# EAGLE design motortreiber_simple (EAGLE 9.6.2)
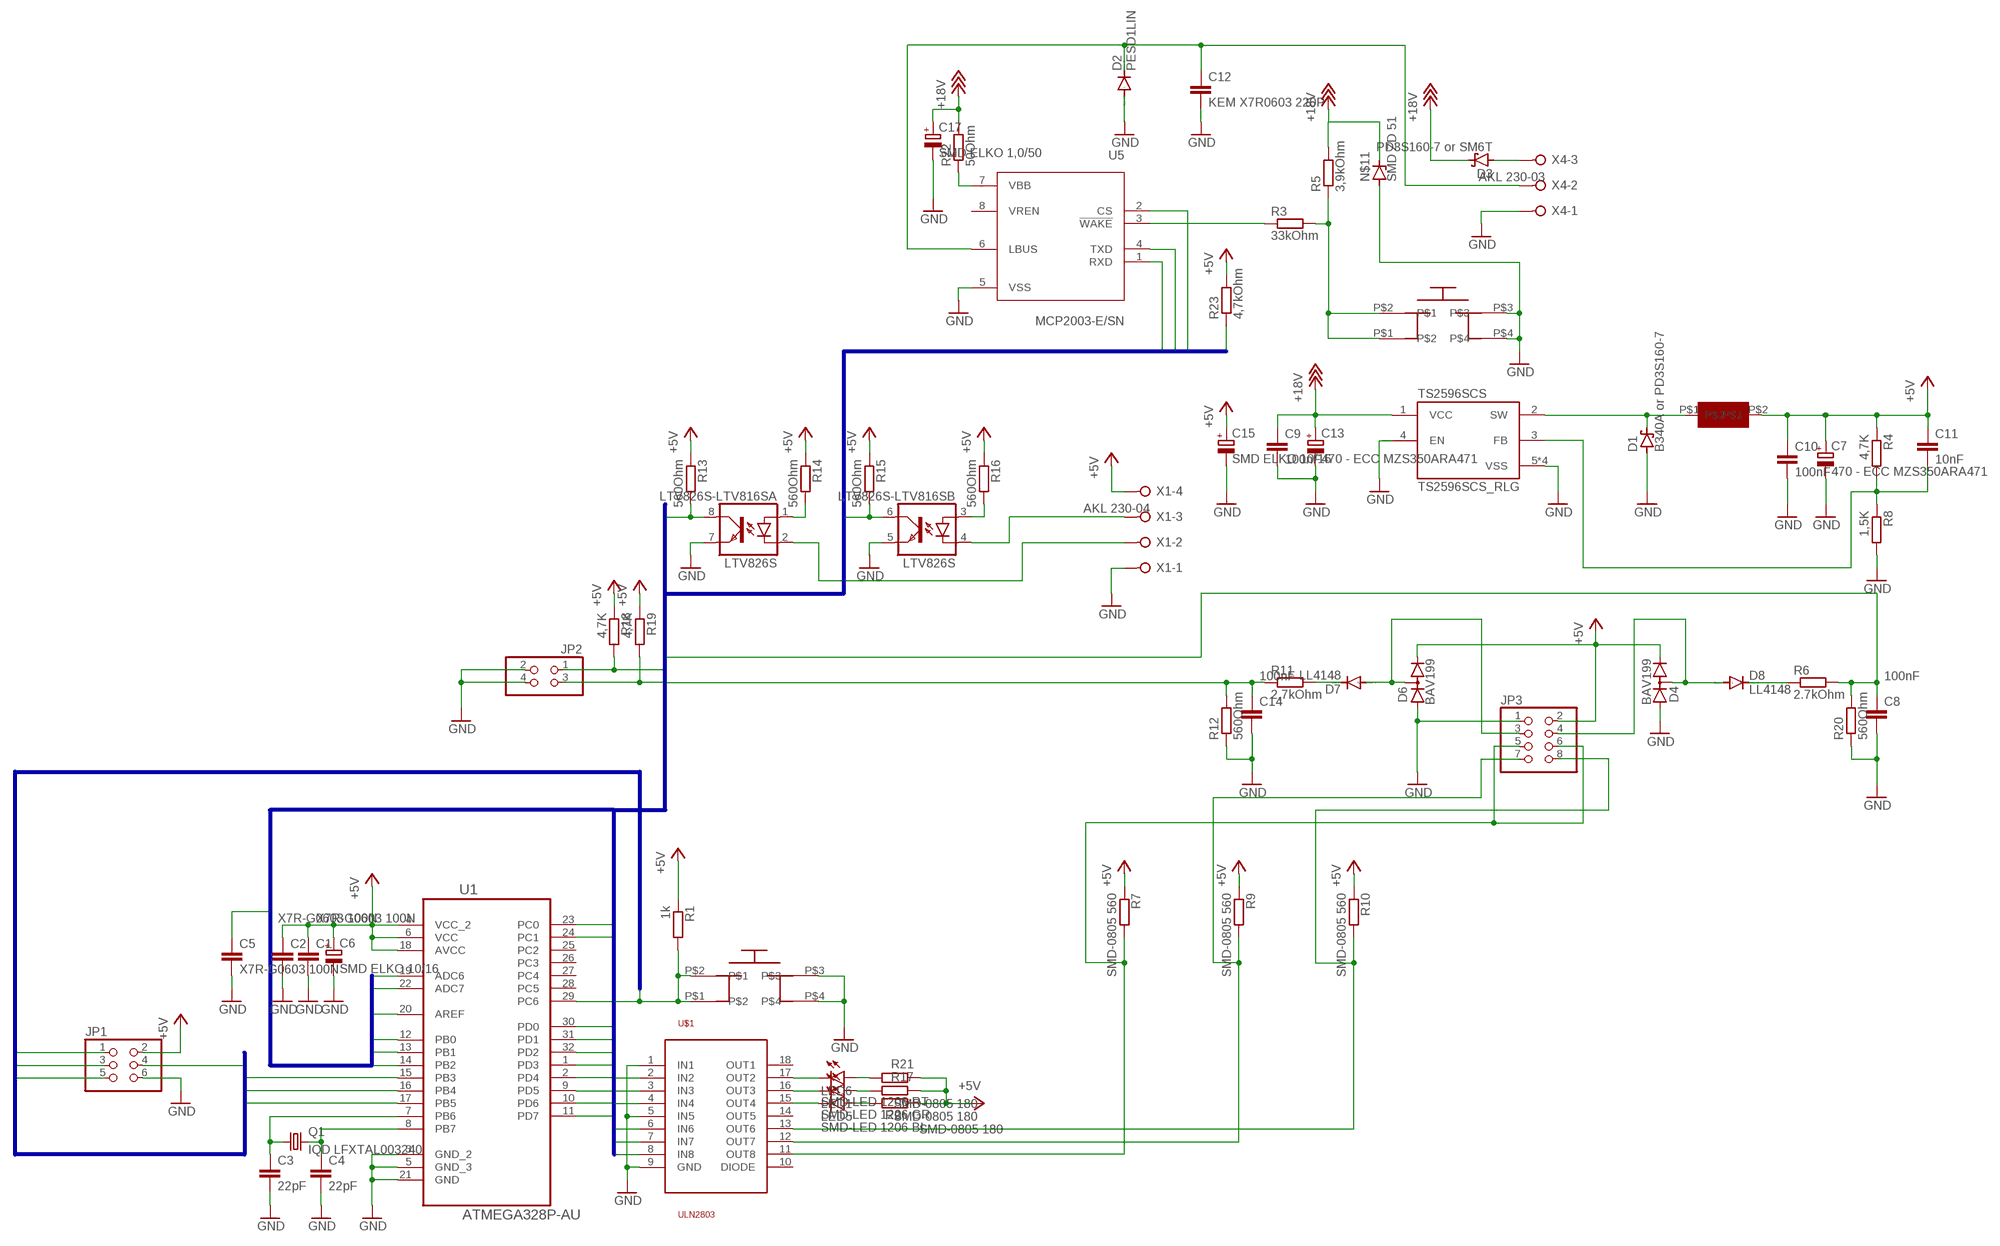
[diagram p0: schematic, sheet 1]

## Parts
C1  X7R-G0603 100N  C-EUC0603  [C0603]
C2  X7R-G0603 100N  C-EUC0603  [C0603]
C3  22pF  C-EUC0603  [C0603]
C4  22pF  C-EUC0603  [C0603]
C5  X7R-G0603 100N  C-EUC0603  [C0603]
C6  SMD ELKO 10/16  CPOL-EU153CLV-0505  [153CLV-0505]
C7  470 - ECC MZS350ARA471  CPOL-EU175TMP-0810  [175TMP-0810]
C8  100nF  C-EUC0603  [C0603]
C9  100nF  C-EUC0603  [C0603]
C10  100nF  C-EUC0603  [C0603]
C11  10nF  C-EUC0603  [C0603]
C12  KEM X7R0603 220P  C-EUC0603  [C0603]
C13  470 - ECC MZS350ARA471  CPOL-EU175TMP-0810  [175TMP-0810]
C14  100nF  C-EUC0603  [C0603]
C15  SMD ELKO 10/16  CPOL-EU153CLV-0505  [153CLV-0505]
C17  SMD ELKO 1,0/50  CPOL-EU153CLV-0405  [153CLV-0405]
D1  B340A or PD3S160-7  SCHOTTKY-DIODESMD  [SMB]
D2  PESD1LIN  DIODE-SOD323-W  [SOD323-W]
D3  PD3S160-7 or SM6T  SCHOTTKY-DIODESMD  [SMB]
D4  BAV199  [SOT23]
D6  BAV199  [SOT23]
D7  LL4148  DIODE-SOD323-W  [SOD323-W]
D8  LL4148  DIODE-SOD323-W  [SOD323-W]
JP1  PINHD-2X3  [2X03]
JP2  PINHD-2X2  [2X02]
JP3  PINHD-2X4  [2X04]
L-05HCP33  LDEVICE2-5MM  [LFOOT2-5MM]
LED1  SMD-LED 1206 GR  LEDCHIPLED_1206  [CHIPLED_1206]
LED5  SMD-LED 1206 BL  LEDCHIPLED_1206  [CHIPLED_1206]
LED6  SMD-LED 1206 RT  LEDCHIPLED_1206  [CHIPLED_1206]
LTV826S-LTV816S  LTV826S  [DIL8-SMD]
N$11  SMD ZD 51  ZENER-DIODESOT23  [SOT23]
Q1  IQD LFXTAL003240  CRYSTALHC49U-V  [HC49U-V]
R1  1k  R-EU_R0805  [R0805]
R2  SMD-0805 180  R-EU_R0805  [R0805]
R3  33kOhm  R-EU_R0805  [R0805]
R4  4,7K  R-EU_R0805  [R0805]
R5  3,9kOhm  R-EU_R0805  [R0805]
R6  2.7kOhm  R-EU_R0805  [R0805]
R7  SMD-0805 560  R-EU_R0805  [R0805]
R8  1,5K  R-EU_R0805  [R0805]
R9  SMD-0805 560  R-EU_R0805  [R0805]
R10  SMD-0805 560  R-EU_R0805  [R0805]
R11  2,7kOhm  R-EU_R0805  [R0805]
R12  560Ohm  R-EU_R0805  [R0805]
R13  560Ohm  R-EU_R0805  [R0805]
R14  560Ohm  R-EU_R0805  [R0805]
R15  560Ohm  R-EU_R0805  [R0805]
R16  560Ohm  R-EU_R0805  [R0805]
R17  SMD-0805 180  R-EU_R0805  [R0805]
R18  4,7K  R-EU_R0805  [R0805]
R19  4,7K  R-EU_R0805  [R0805]
R20  560Ohm  R-EU_R0805  [R0805]
R21  SMD-0805 180  R-EU_R0805  [R0805]
R22  50Ohm  R-EU_R0805  [R0805]
R23  4,7kOhm  R-EU_R0805  [R0805]
TASTER9313-1  SCHALTDEV  [SCHALTFOOT]
TASTER9313-2  SCHALTDEV  [SCHALTFOOT]
TS2596SCS  TS2596SCS_RLG  [SOP127P600X200-8N]
U1  ATMEGA328P-AU  [QFP80P900X900X120-32N]
U5  MCP2003-E/SN  [SOIC127P600X175-8N]
U$1  ULN2803  [SO18L]
X1  AKL 230-04  W237-04P  [W237-4P]
X4  AKL 230-03  W237-3E  [W237-3E]

## Nets
+5V: C1.1 C2.1 C6.+ C7.+ C10.1 C11.1 C15.+ D4.2(C) D6.2(C) JP1.2 JP3.2 L-05HCP33.P$2 R1.1 R2.1 R4.1 R7.1 R9.1 R10.1 R13.1 R14.1 R15.1 R16.1 R17.1 R18.1 R19.1 R21.1 R23.2 U1.4(VCC_2) U1.6(VCC) U1.18(AVCC) X1.4
+18V: C9.1 C13.+ C17.+ D3.C N$11.3(C) R5.2 R22.2 TS2596SCS.1(VCC)
ADC6: C8.1 R6.2 R20.2 U1.19(ADC6)
ADC7: C14.1 R11.1 R12.2 U1.22(ADC7)
AREF: C5.1 U1.20(AREF)
CLK: JP1.3 U1.17(PB5)
GND: C1.2 C2.2 C3.2 C4.2 C5.2 C6.- C7.- C8.2 C9.2 C10.2 C12.2 C13.- C14.2 C15.- C17.- D1.A D2.A D4.1(A) D6.1(A) JP1.6 JP2.2 JP2.4 JP3.1 LTV826S-LTV816S.5(B:EMIT) LTV826S-LTV816S.7(A:EMIT) N$11.1(A) R8.2 R12.1 R20.1 TASTER9313-1.P$3 TASTER9313-1.P$4 TASTER9313-2.P$3 TASTER9313-2.P$4 TS2596SCS.4(EN) TS2596SCS.5(VSS) TS2596SCS.6(VSS) TS2596SCS.7(VSS) TS2596SCS.8(VSS) U1.3(GND_2) U1.5(GND_3) U1.21(GND) U5.5(VSS) U$1.1(IN1) U$1.5(IN5) U$1.9(GND) X1.1 X4.1
INT0: LTV826S-LTV816S.8(A:COL) R13.2 U1.32(PD2)
INT1: LTV826S-LTV816S.6(B:COL) R15.2 U1.1(PD3)
LED0: U1.12(PB0) U$1.4(IN4)
LED1: U1.13(PB1) U$1.3(IN3)
LED2: U1.14(PB2) U$1.2(IN2)
MISO: JP1.1 U1.16(PB4)
MOSI: JP1.4 U1.15(PB3)
N$1: LTV826S-LTV816S.3(B:A) R16.2
N$2: LTV826S-LTV816S.4(B:C) X1.3
N$3: LTV826S-LTV816S.2(A:C) X1.2
N$4: LTV826S-LTV816S.1(A:A) R14.2
N$5: R22.1 U5.7(VBB)
N$6: LED6.C U$1.17(OUT2)
N$7: LED5.A R2.2
N$8: LED1.A R17.2
N$9: C3.1 Q1.1 U1.7(PB6)
N$10: C4.1 Q1.2 U1.8(PB7)
N$11: C12.1 D2.C U5.6(LBUS) X4.2
N$12: R3.1 U5.3(!WAKE)
N$13: D1.C L-05HCP33.P$1 TS2596SCS.2(SW)
N$14: C11.2 R4.2 R8.1 TS2596SCS.3(FB)
N$15: JP3.5 JP3.6 R7.2 U$1.11(OUT8)
N$16: D6.3(AC) D7.A JP3.3
N$17: R3.2 R5.1 TASTER9313-1.P$1 TASTER9313-1.P$2
N$18: D3.A X4.3
N$19: D4.3(AC) D8.A JP3.4
N$20: D7.C R11.2
N$21: JP3.7 R9.2 U$1.12(OUT7)
N$22: D8.C R6.1
N$23: LED1.C U$1.16(OUT3)
N$25: LED6.A R21.2
N$26: LED5.C U$1.15(OUT4)
N$28: JP3.8 R10.2 U$1.13(OUT6)
NSLP: U1.2(PD4) U5.2(CS)
O0: U1.10(PD6) U$1.7(IN7)
O1: U1.11(PD7) U$1.6(IN6)
P0: JP2.3 R19.2 U1.23(PC0)
P1: JP2.1 R18.2 U1.24(PC1)
PWM: U1.9(PD5) U$1.8(IN8)
RESET: JP1.5 R1.2 TASTER9313-2.P$1 TASTER9313-2.P$2 U1.29(PC6)
RX: R23.1 U1.30(PD0) U5.1(RXD)
TX: U1.31(PD1) U5.4(TXD)
Unconnected: U1.25(PC2) U1.26(PC3) U1.27(PC4) U1.28(PC5) U5.8(VREN) U$1.10(DIODE) U$1.14(OUT5) U$1.18(OUT1)

## Buses
AUX:ADC6,ADC7,AREF,INT0,INT1,LED0,LED1,LED2,LED3,NSLP,O0,O1,O2,O3,P0,P1,PWM,RX,TX
ICSP:CLK,MISO,MOSI,RESET

## Library data of the parts
C1-C5 C8-C12 C14 = rcl:C-EU: CAPACITOR, European symbol; SPICEPREFIX: C
C6 C7 C13 C15 C17 = rcl:CPOL-EU: POLARIZED CAPACITOR, European symbol; SPICEPREFIX: C
D1 D3 = diode:SCHOTTKY-DIODE: Schottky Diode
D2 D7 D8 = diode:DIODE-: DIODE
D4 D6 = diode:BAV199: DIODE low-leakage double diode
JP1 = pinhead:PINHD-2X3: PIN HEADER
JP2 = pinhead:PINHD-2X2: PIN HEADER
JP3 = pinhead:PINHD-2X4: PIN HEADER
L-05HCP33 = own:LDEVICE2-5MM
LED1 LED5 LED6 = led:LED: LED OSRAM: - CHIPLED LG R971, LG N971, LY N971, LG Q971, LY Q971, LO R971, LY R971 LH N974, LH R974 LS Q976, LO Q976, LY Q976 LO Q996 - Hyper CHIPLED LW Q18S LB Q993, LB Q99A, LB R99A - SideLED LS A670, LO A670, LY A670, LG A670, LP A670 LB A673, LV A673, LT A673, LW A673 LH A674 LY A675 LS A676, LA A676, LO A676, LY A676, LW A676 LS A679, LY A679, LG A679 - Hyper Micro SIDELED® LS Y876, LA Y876, LO Y876, LY Y876 LT Y87S - SmartLED LW L88C, LW L88S LB L89C, LB L89S, LG L890 LS L89K, LO L89K, LY L89K LS L896, LA L896, LO L896, LY L896 - TOPLED LS T670, LO T670, LY T670, LG T670, LP T670 LSG T670, LSP T670, LSY T670, LOP T670, LYG T670 LG T671, LOG T671, LSG T671 LB T673, LV T673, LT T673, LW T673 LH T674 LS T676, LA T676, LO T676, LY T676, LB T676, LH T676, LSB T676, LW T676 LB T67C, LV T67C, LT T67C, LS T67K, LO T67K, LY T67K, LW E67C LS E67B, LA E67B, LO E67B, LY E67B, LB E67C, LV E67C, LT E67C LW T67C LS T679, LY T679, LG T679 LS T770, LO T770, LY T770, LG T770, LP T770 LB T773, LV T773, LT T773, LW T773 LH T774 LS E675, LA E675, LY E675, LS T675 LS T776, LA T776, LO T776, LY T776, LB T776 LHGB T686 LT T68C, LB T68C - Hyper Mini TOPLED® LB M676 - Mini TOPLED Santana® LG M470 LS M47K, LO M47K, LY M47K Source: http://www.osram.convergy.de LUXEON: - LUMILED® LXK2-PW12-R00, LXK2-PW12-S00, LXK2-PW14-U00, LXK2-PW14-V00 LXK2-PM12-R00, LXK2-PM12-S00, LXK2-PM14-U00 LXK2-PE12-Q00, LXK2-PE12-R00, LXK2-PE12-S00, LXK2-PE14-T00, LXK2-PE14-U00 LXK2-PB12-K00, LXK2-PB12-L00, LXK2-PB12-M00, LXK2-PB14-N00, LXK2-PB14-P00, LXK2-PB14-Q00 LXK2-PR12-L00, LXK2-PR12-M00, LXK2-PR14-Q00, LXK2-PR14-R00 LXK2-PD12-Q00, LXK2-PD12-R00, LXK2-PD12-S00 LXK2-PH12-R00, LXK2-PH12-S00 LXK2-PL12-P00, LXK2-PL12-Q00, LXK2-PL12-R00 Source: www.luxeon.com KINGBRIGHT: KA-3528ASYC Source: www.kingbright.com
LTV826S-LTV816S = optocoupler:LTV826: OPTO COUPLER Source: LITEON, LTV816.pdf; OC_FARNELL: unknown; OC_NEWARK: unknown
N$11 = diode:ZENER-DIODE: Z-Diode
Q1 = crystal:CRYSTAL: CRYSTAL; OC_FARNELL: 1666969; OC_NEWARK: unknown
R1-R23 = rcl:R-EU_: RESISTOR, European symbol; SPICEPREFIX: R
TASTER9313-1 TASTER9313-2 = own:SCHALTDEV
TS2596SCS = TS2596SCS_RLG:TS2596SCS_RLG; MANUFACTURER: Taiwan Semiconductor; MAXIMUM_PACKAGE_HEIGHT: 2.00mm; PARTREV: C1602; STANDARD: IPC-7351B
U1 = Atmel_By_element14_Batch_1-00:ATMEGA328P-AU: 8-bit Microcontroller with In-System Programmable Flash; MPN: ATMEGA328P-AU; OC_FARNELL: 1715486; OC_NEWARK: 14R4631; PACKAGE: TQFP-32; SUPPLIER: Atmel
U5 = MCP2003-E_SN:MCP2003-E/SN: MCP2003 Series 6 to 27 V Bidirectional LIN J2602 Transceiver SMT - SOIC-8; A1_MIN: 0.1; A_MAX: 1.75; A_MIN: 1.75; A_NOM: 1.75; B_MAX: 0.51; B_MIN: 0.31; B_NOM: 0.41; D2_MAX: 0.0; D_MAX: 4.9; D_MIN: 4.9; D_NOM: 4.9; E1_MAX: 3.9; E1_MIN: 3.9; E1_NOM: 3.9; E2_MAX: 0.0; ENOM: 1.27; E_MAX: 6.0; E_MIN: 6.0; E_NOM: 6.0; L_MAX: 1.27; L_MIN: 0.4; L_NOM: 0.835; MANUFACTURER: Microchip; MAXIMUM_PACKAGE_HEIGHT: 1.75mm; PARTREV: G; PIN_COUNT: 8.0; STANDARD: IPC 7351B
U$1 = uln2803:ULN2803
X1 = con-wago-508:W237-04P: WAGO SREW CLAMP; OC_FARNELL: unknown; OC_NEWARK: unknown
X4 = con-wago-508:W237-3E: WAGO SREW CLAMP; OC_FARNELL: unknown; OC_NEWARK: unknown

## Board
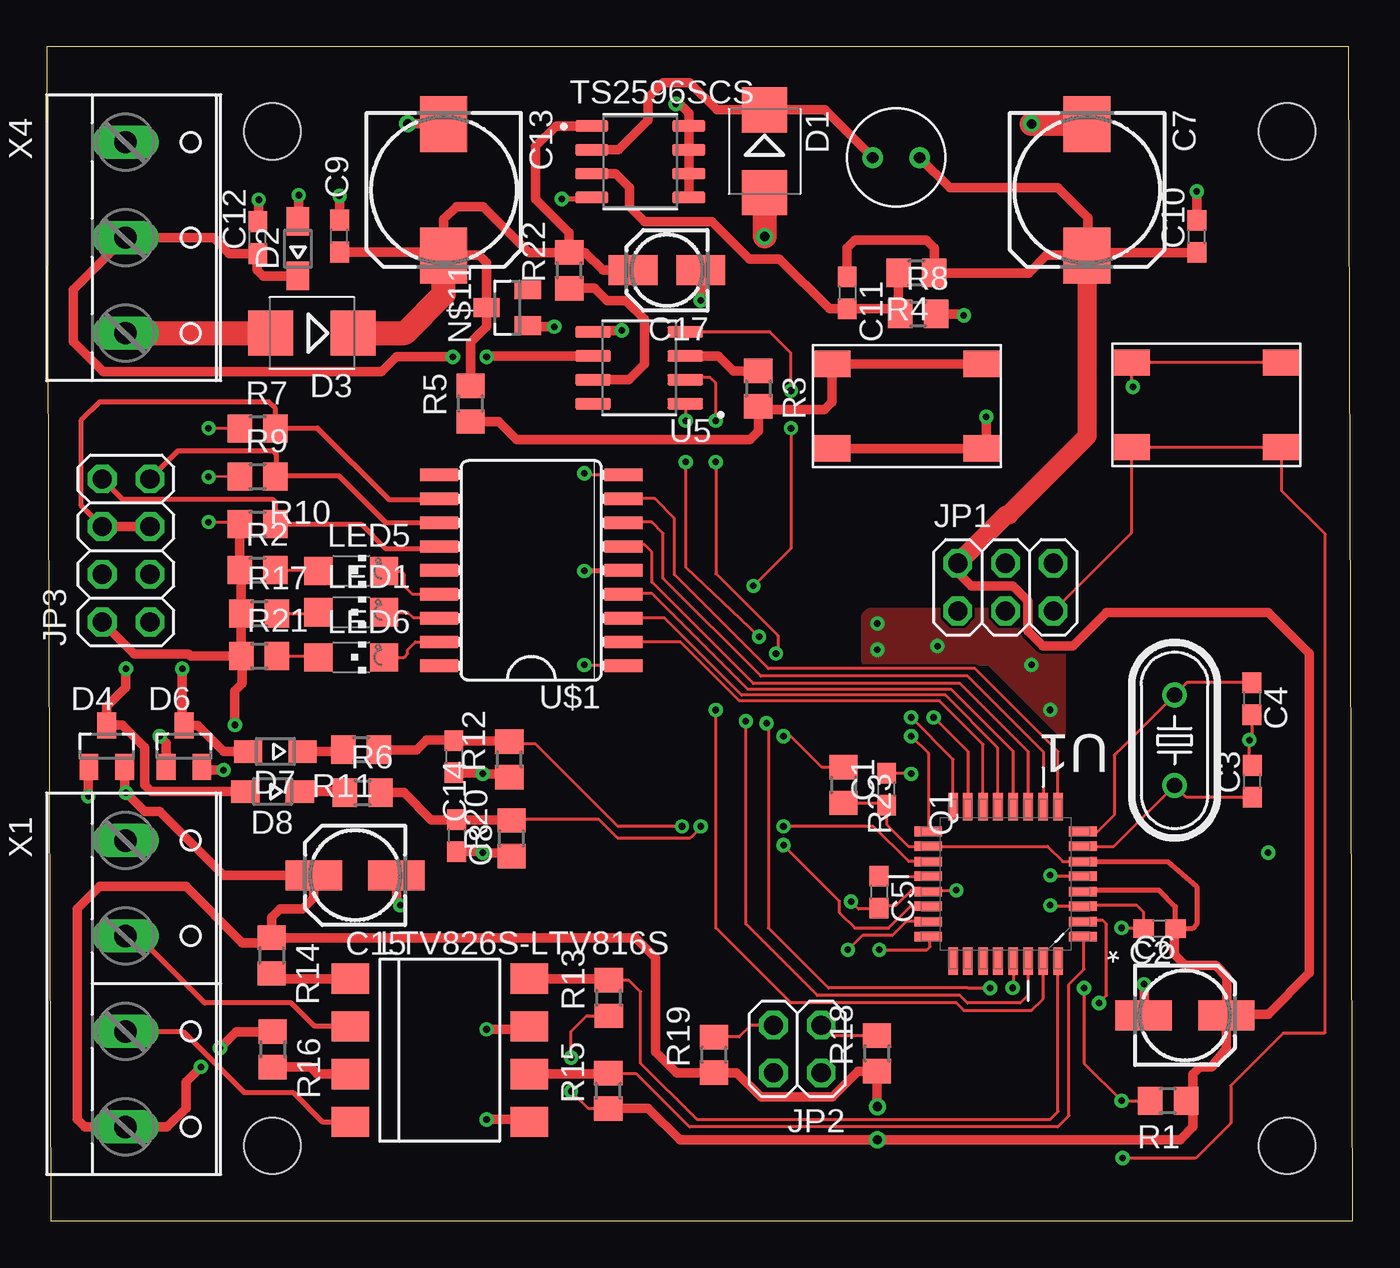
[diagram p1: board, top side]
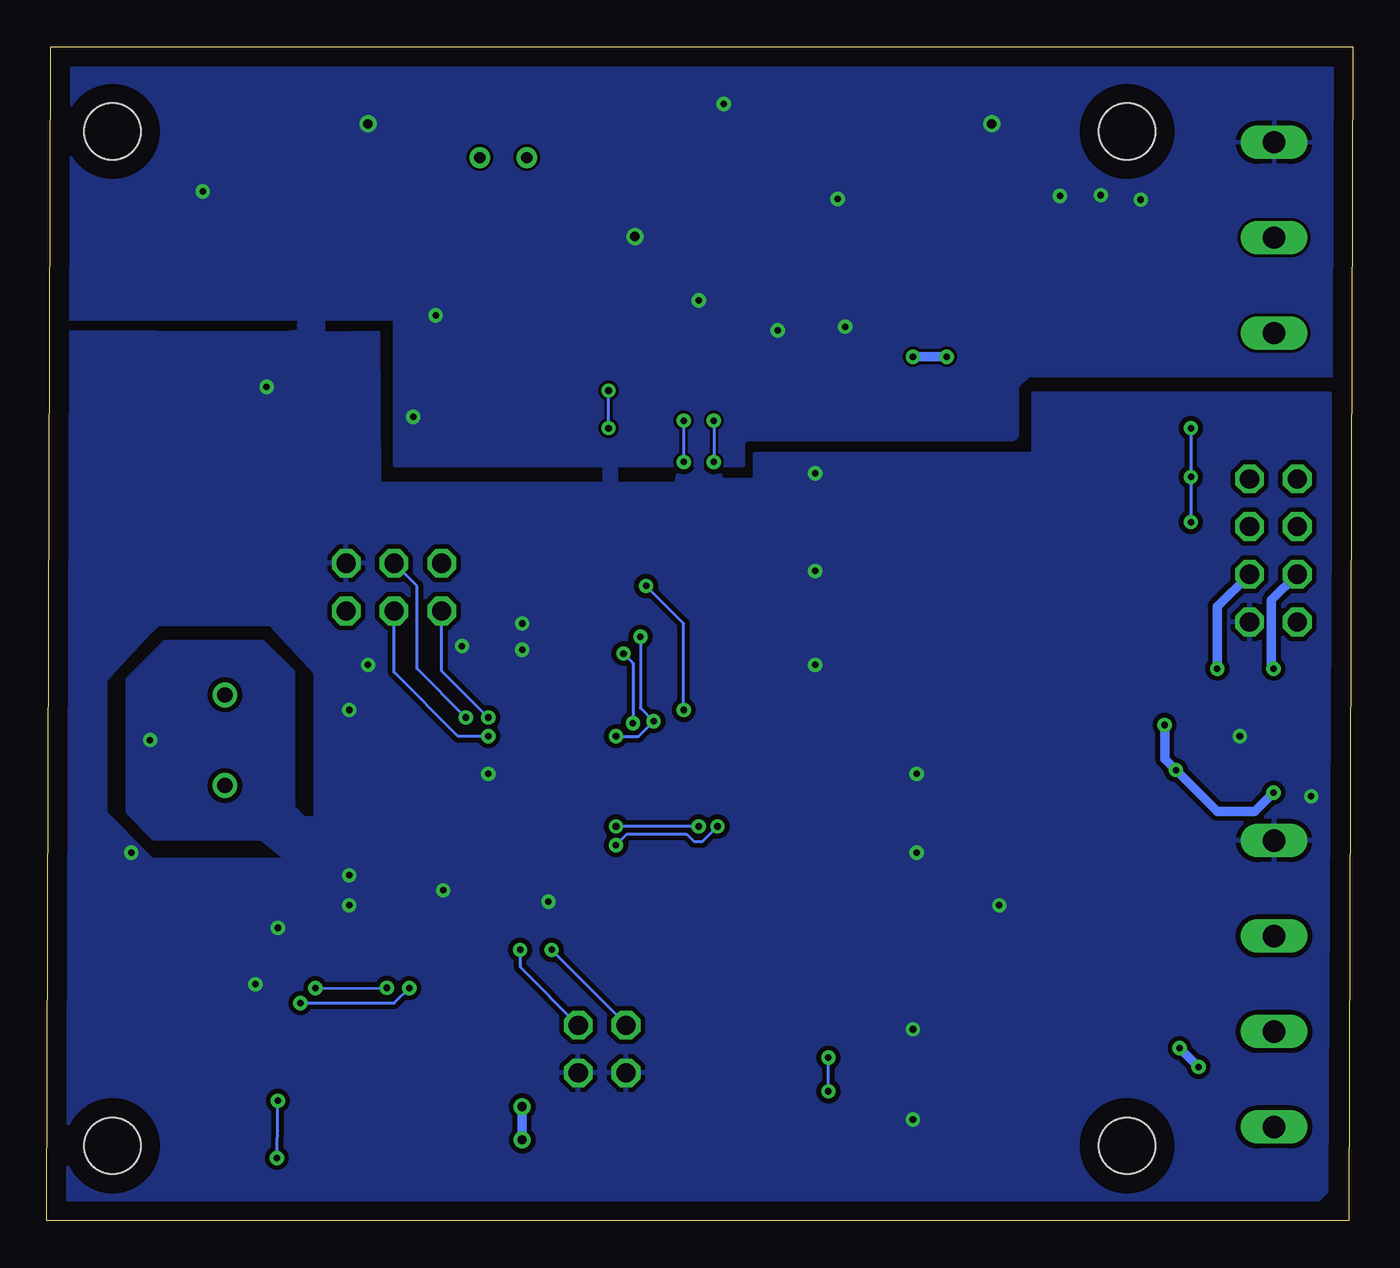
[diagram p2: board, bottom side, seen from below]

Size 69.49 x 62.49 mm. Coordinates in mm from the lower left corner, seen from the top.
Outline: 0.2,0 69.49,0 69.29,62.49 0,62.49 0.2,0
Copper layers (1*16): Top 0.035mm / dielectric 1.5mm / Bottom 0.035mm
Design rules "default *": minimum track width 6mil, minimum drill 0.35mm, track to track 6mil, track to pad 6mil, pad to pad 6mil, via to via 6mil, smd to smd 6mil, copper to edge 40mil, drill to drill 12mil, minimum pad ring 10mil, minimum via ring 8mil, stop-mask expansion 4mil, vias tented up to drill 0mil, thermal gap 10mil
Holes 3 mm at 66,58 66,4 12,4 12,58

### Footprints (pad centres in the part's own frame; a part is rotated, then mirrored left to right if it is on the bottom)
C0603 = smd 1.1 x 1: 1 -0.85,0; 2 0.85,0
153CLV-0505 = smd 3 x 1.6: + 2.2,0; - -2.2,0
175TMP-0810 = smd 3 x 2.5: + 3.5,0; - -3.5,0
153CLV-0405 = smd 2.6 x 1.6: + 1.8,0; - -1.8,0
SMB = smd 2.4 x 2.4: A 2.2,0; C -2.2,0
SOD323-W = smd 1.5 x 1.2: A 1.45,0; C -1.45,0
SOT23 = smd 1 x 1.4: 1 -0.95,-1.1; 2 0.95,-1.1; 3 0,1.1
2X03 = drill 1.016 octagon: 1 -2.54,-1.27; 2 -2.54,1.27; 3 0,-1.27; 4 0,1.27; 5 2.54,-1.27; 6 2.54,1.27
2X02 = drill 1.016 octagon: 1 -1.27,-1.27; 2 -1.27,1.27; 3 1.27,-1.27; 4 1.27,1.27
2X04 = drill 1.016 octagon: 1 -3.81,-1.27; 2 -3.81,1.27; 3 -1.27,-1.27; 4 -1.27,1.27; 5 1.27,-1.27; 6 1.27,1.27; 7 3.81,-1.27; 8 3.81,1.27
LFOOT2-5MM = drill 0.6: P$1 1.25,0; P$2 -1.25,0
CHIPLED_1206 = smd 1.5 x 1.5: A 0,-1.75; C 0,1.75
DIL8-SMD = smd 1.6 x 2: 1 -3.81,-4.77; 2 -1.27,-4.77; 3 1.27,-4.77; 4 3.81,-4.77; 5 3.81,4.77; 6 1.27,4.77; 7 -1.27,4.77; 8 -3.81,4.77
HC49U-V = drill 0.813: 1 -2.413,0; 2 2.413,0
R0805 = smd 1.3 x 1.5: 1 -0.95,0; 2 0.95,0
SCHALTFOOT = smd 2 x 1.4: P$1 4,2.25; P$2 -4,2.25; P$3 -4,-2.25; P$4 4,-2.25
SOP127P600X200-8N = smd 1.76 x 0.6: 1 -2.58,1.905; 2 -2.58,0.635; 3 -2.58,-0.635; 4 -2.58,-1.905; 5 2.58,-1.905; 6 2.58,-0.635; 7 2.58,0.635; 8 2.58,1.905
QFP80P900X900X120-32N = smd 1.473 x 0.508: 1 -4.115,2.794; 2 -4.115,2.007; 3 -4.115,1.194; 4 -4.115,0.406; 5 -4.115,-0.406; 6 -4.115,-1.194; 7 -4.115,-2.007; 8 -4.115,-2.794; 17 4.115,-2.794; 18 4.115,-2.007; 19 4.115,-1.194; 20 4.115,-0.406; 21 4.115,0.406; 22 4.115,1.194; 23 4.115,2.007; 24 4.115,2.794 | smd 0.508 x 1.473: 9 -2.794,-4.115; 10 -2.007,-4.115; 11 -1.194,-4.115; 12 -0.406,-4.115; 13 0.406,-4.115; 14 1.194,-4.115; 15 2.007,-4.115; 16 2.794,-4.115; 25 2.794,4.115; 26 2.007,4.115; 27 1.194,4.115; 28 0.406,4.115; 29 -0.406,4.115; 30 -1.194,4.115; 31 -2.007,4.115; 32 -2.794,4.115
SOIC127P600X175-8N = smd 1.9 x 0.6: 1 -2.455,1.905; 2 -2.455,0.635; 3 -2.455,-0.635; 4 -2.455,-1.905; 5 2.455,-1.905; 6 2.455,-0.635; 7 2.455,0.635; 8 2.455,1.905
SO18L = smd 0.66 x 2.032: 1 -5.08,-4.902; 2 -3.81,-4.902; 3 -2.54,-4.902; 4 -1.27,-4.902; 5 0,-4.902; 6 1.27,-4.902; 7 2.54,-4.902; 8 3.81,-4.902; 9 5.08,-4.902; 10 5.08,4.902; 11 3.81,4.902; 12 2.54,4.902; 13 1.27,4.902; 14 0,4.902; 15 -1.27,4.902; 16 -2.54,4.902; 17 -3.81,4.902; 18 -5.08,4.902
W237-4P = drill 1.194 long: 1 -7.62,-0.635; 2 -2.54,-0.635; 3 2.54,-0.635; 4 7.62,-0.635
W237-3E = drill 1.194 long: 1 -5.08,-0.635; 2 0,-0.635; 3 5.08,-0.635

### Placement (x,y rotation side)
C1  44.69,22.99 90 top
C2  59.22,15.56 180 top
C3  64.15,23.4 90 top
C4  64.13,27.8 270 top
C5  44.28,17.5 270 top
C6  60.57,10.95 0 top
C7  55.36,54.88 270 top
C8  21.8,20.51 270 top
C9  15.57,52.42 90 top
C10  61.2,52.4 90 top
C11  42.59,49.4 270 top
C12  11.23,52.34 90 top
C13  21.12,54.88 270 top
C14  21.66,24.71 270 top
C15  16.4,18.4 180 top
C17  33,50.6 180 top
D1  38.2,56.94 270 top
D2  13.36,51.75 90 top
D3  14.1,47.26 180 top
D4  3.18,25.27 0 top
D6  7.3,25.27 0 top
D7  12.16,24.99 180 top
D8  12.01,22.86 180 top
JP1  51.02,33.74 0 top
JP2  39.94,9.15 180 top
JP3  4.21,35.69 90 top
L-05HCP33  45.2,56.6 180 top
LED1  16.2,32.4 270 top
LED5  16.2,34.6 270 top
LED6  16.2,30 270 top
LTV826S-LTV816S  20.91,9.09 270 top
N$11  24.5,48.61 90 top
Q1  60.02,25.59 90 top
R1  59.67,6.39 180 top
R2  11.22,34.65 0 top
R3  37.86,44.3 270 top
R4  46.28,50.46 180 top
R5  22.55,43.5 90 top
R6  16.81,22.8 0 top
R7  11.21,42.17 0 top
R8  46.37,48.28 0 top
R9  11.21,39.63 0 top
R10  11.21,37.09 0 top
R11  16.72,25.08 180 top
R12  24.61,24.57 90 top
R13  29.9,11.87 90 top
R14  11.96,14.13 270 top
R15  29.88,6.93 90 top
R16  12.02,9.13 270 top
R17  11.29,32.33 0 top
R18  44.18,8.92 90 top
R19  35.5,8.84 90 top
R20  24.73,20.37 90 top
R21  11.29,30.07 0 top
R22  27.8,50.6 90 top
R23  42.4,23.2 270 top
TASTER9313-1  45.77,43.37 0 top
TASTER9313-2  61.71,43.44 180 top
TS2596SCS  31.58,56.38 0 top
U1  51.02,17.94 180 top
U5  31.52,45.41 180 top
U$1  25.78,34.63 90 top
X1  4.81,12.63 270 top
X4  4.81,52.34 270 top

### Tracks (layer width: path | path; a pad name or v marks a point on that pad's centre or on a via)
+5V  (via drill 0.35, 0.5)
  Top 0.152: R9.1 9.83,39.63 v8.6,39.6 | R7.1 8.83,42.17 v8.6,42.2 | 29.9,6 R15.1 28.82,5.98 v27.9,6.9 | v27.9,8.7 27.9,10.1 28.72,10.92 R13.1 | v8.6,37.2 10.15,37.2 R10.1 | R23.2 44.58,22.25 C1.1 44.69,21.11 45.85,19.95 U1.18 53.25,19.95 54.07,19.13 55.2,19.13
  Top 0.254: C7.+ 55.6,51.38 | C2.1 60.07,16.73 59.2,17.6 55.2,17.6 U1.4 | C2.1 60,15.49 | U1.6 55.2,19.13 59.67,19.13 61.2,17.8 61.2,15.8 60.96,15.56 C2.1
  Top 0.508: D6.2 8.42,24 v9.4,24 | R14.1 12.24,14.8 10.4,14.8 7.4,17.8 2.8,17.8 1.6,16.6 1.6,5.4 2,5 X1.4 | R14.1 31.32,15.08 32.4,14 32.4,9 33.51,7.89 R19.1 36.71,7.89 38,6.6 41.8,6.6 43.17,7.97 R18.1 44.18,6.1 v44.2,6.08 | 29.9,6 32,6 33.68,4.32 v44.2,4.32 60.32,4.32 61,5 61,6.41 | C6.+ 62.77,9.17 62,8.2 61.4,8.2 61,7.8 61,6.41 | 61,6.41 R1.1 | JP1.2 48.48,34.52 49.2,33.8 51.4,33.8 52.2,33 52.2,31.4 53,30.6 54.6,30.6 56.4,32.4 65,32.4 67.2,30.2 67.2,13.2 65,11 62.82,11 C6.+ | X1.4 | R16.1 10.08,10.08 v9.2,9.2 | v8.2,8.2 7.4,7.4 7.4,6 6.4,5 X1.4 | R10.1 R2.1 10.34,34.58 R17.1 R21.1 | R21.1 7.64,30.07 7.53,30.18 4.63,30.18 JP3.2 | R14.1 11.96,16.16 12.4,16.6 13.6,16.6 14.2,17.2 C15.+ 9.4,18.4 6,21.8 5.2,21.8 v4.2,22.8 4.13,22.87 D4.2 | 60,15.49 60,14.2 60.6,13.6 62.2,13.6 62.8,13 62.8,10.98 C6.+ | v10,26.4 10,28.2 10.4,28.6 10.4,30.01 R21.1 | L-05HCP33.P$2 48.05,55 53.8,55 55.4,53.4 55.4,51.42 | 55.4,51.42 C7.+ | 55.6,51.38 55.58,51.4 53.2,51.4 52.26,50.46 R4.1 47.23,51.77 46.8,52.2 43,52.2 42.59,51.79 C11.1 | C10.1 55.53,51.55 55.4,51.42
  Top 1.016: C7.+ 55.36,41.76 51.2,37.6 51.07,37.6 JP1.2
  Bottom 0.152: v8.6,42.2 v8.6,39.6 v8.6,37.2 | v27.9,6.9 v27.9,8.7
  Bottom 0.508: v4.2,22.8 5.2,21.8 7.2,21.8 v9.4,24 10,24.6 v10,26.4 | v44.2,4.32 v44.2,6.08 | v9.2,9.2 v8.2,8.2
+18V
  Top 0.508: 21.14,51.4 23,51.4 23.4,51 N$11.3 23.4,47.6 22.55,46.75 R5.2 | 21.14,51.4 C13.+ 21.12,53.32 21.8,54 23.2,54 25.65,51.55 R22.2 | C9.1 20.97,51.57 21.14,51.4 | C17.+ 29.6,50.6 28.65,51.55 R22.2 | TS2596SCS.1 27.09,58.28 26,57.2 26,54.4 27.8,52.6 R22.2
  Top 1.27: D3.C 19.05,47.26 21.12,49.33 C13.+
ADC6  (via drill 0.35)
  Top 0.152: U1.19 45.87,19.13 44,21 v39.2,21 | R20.2 24.81,21.4 29.37,21.4 30.38,20.39 34.25,20.39 34.79,20.93 v34.79,21
  Top 0.508: R6.2 19,22.8 20.44,21.36 C8.1 24.69,21.36 R20.2
  Bottom 0.152: v34.79,21 v39.2,21
ADC7  (via drill 0.35)
  Top 0.152: v33.8,21 30.4,21 26,25.4 24.73,25.4 R12.2 | v39.21,20 42.19,17.01 42.19,16.41 43,15.6 44.8,15.6 45.95,16.75 U1.22
  Top 0.508: R11.1 19.68,25.08 20.2,25.6 21.62,25.6 C14.1 24.57,25.56 R12.2
  Bottom 0.152: v39.21,20 38.61,20.6 35.45,20.6 35.05,20.19 34.61,20.19 v33.8,21
AREF
  Top 0.152: C5.1 U1.20
CLK  (via drill 0.35)
  Top 0.152: v46,25.8 46.91,24.91 U1.17
  Bottom 0.152: v46,25.8 47.6,25.8 51.02,29.22 JP1.3
GND  (via drill 0.35, 0.5)
  Top 0.152: v53.4,16.8 53.45,16.75 U1.3 55.19,16.8 58,16.8 58.37,16.43 C2.2 58.33,15.6 v57.2,15.6 | U1.21 46.97,17.6 | 46.97,17.6 v48.4,17.6 | U1.5 53.45,18.35 v53.4,18.4 | 46.97,17.6 46,17.6 45.2,16.8 44.43,16.8 C5.2 44.23,16.6 43.2,16.6 v42.8,17 | C1.2 45.96,23.84 v46,23.8 | 25.66,47.6 N$11.1 | TASTER9313-2.P$3 TASTER9313-2.P$4 57.71,44.49 v57.8,44.4 | C4.2 64.13,25.73 v64,25.6 64,24.4 C3.2 | U$1.9 28.69,39.71 v28.6,39.8 | v28.6,29.6 30.63,29.6 U$1.1
  Top 0.254: U$1.5 30.25,34.6 v28.6,34.6 | TS2596SCS.4 28.93,54.4 v27.4,54.4
  Top 0.508: v33.47,59.46 33.67,59.46 34.16,58.97 TS2596SCS.8 TS2596SCS.7 TS2596SCS.6 TS2596SCS.5 | TASTER9313-1.P$3 TASTER9313-1.P$4 50,41.12 v50,42.8 | U5.5 29.15,47.4 v30.6,47.4 | C14.2 23.14,23.86 v23.2,23.8 24.43,23.8 R12.1 | C8.2 23.14,19.66 v23.2,19.6 24.55,19.6 R20.1 | v2.2,22.6 2.2,24.14 D4.1 | v6,25.8 6.35,25.45 D6.1 | v23.4,10.2 25.52,10.2 LTV826S-LTV816S.7 | v23.4,5.4 25.56,5.4 LTV826S-LTV816S.5 | v58.4,12.6 58.4,10.95 C6.- | v19.2,58.4 21.1,58.4 C13.- | v18.8,16.8 18.6,17 C15.- | v15.57,54.56 C9.2 | v48.8,48.2 48.72,48.28 R8.2 | v11.27,54.36 11.27,53.23 C12.2 | v27,47.6 25.66,47.6 | D2.A 13.4,53.24 v13.4,54.6 | C17.- v34.8,49 | C10.2 v61.2,54.8
  Top 1.27: D1.A v38.2,52.4 | v52.4,58.4 55.34,58.4 C7.-
  other vias: 65,19.6 53.4,27.2 44.2,31.8 44.2,30.4 47.4,30.6 52.4,29.6
  pour Bottom (isolate 0.254): 17,40.8 31.8,40.8 31.8,39.4 33.6,39.4 34.06,41 35.6,41 36,39.2 39.2,39.2 39.2,40.4 39.8,40.4 39.8,39.2 51.8,39.21 51.85,47.27 54.8,47.2 54.8,48.6 56,48.6 56.1,47.3 56.9,47.22 63.8,47.27 68.6,47.29 68.4,20 66.4,20 66.4,28.8 66.2,29 64,31.4 63.6,31.8 57.6,31.8 55.2,29.2 55.2,21.4 55.8,21.4 56.4,22 56.4,29.2 58,30.8 63.2,30.8 65.2,28.8 65.2,21.8 63.8,20.4 58.1,20.4 56.6,19.2 68.4,19.2 68.6,0.8 2.2,0.8 1.4,1.6 1.2,37 1.2,44 17,44
  pour Bottom: 0.8,62 68.8,62 68.8,48 51,48 51,40.2 32.4,40.2 32.4,41.4 32.2,41.6 18,41.6 17.8,41.8 17.8,44.4 17.2,45 1,45 0.8,61.6 0.8,61.6
  pour Bottom: 63.8,18.4 63.8,19.2 66.6,22 68.4,22 68.4,18.4
  pour Top: 45.4,32.4 52.8,32.4 53.8,31.4 54,31.2 54,26 50.2,29.8 43.6,29.8 43.6,32.2 43.8,32.4
INT0
  Top 0.152: R13.2 30.98,12.82 31.6,12.2 31.6,8.4 34.6,5.4 53.4,5.4 53.81,5.81 U1.32
  Top 0.508: LTV826S-LTV816S.8 29.82,12.9 R13.2
INT1
  Top 0.152: 29.82,7.82 31.38,7.82 34.2,5 53.8,5 54.4,5.6 54.4,12.6 55.19,13.39 55.19,15.09 U1.1
  Top 0.508: LTV826S-LTV816S.6 29.82,7.82 R15.2
LED0
  Top 0.152: U$1.4 30.32,33.4 32.2,33.4 37.3,28.3 48.14,28.3 51.43,25 U1.12
LED1
  Top 0.152: U1.13 50.61,25.19 47.81,27.99 36.98,27.99 32.88,32.09 U$1.3
LED2
  Top 0.152: U1.14 49.83,25.37 47.51,27.69 36.85,27.69 33.72,30.82 U$1.2
MISO  (via drill 0.35)
  Top 0.152: U1.16 48.23,24.57 v46,26.8
  Bottom 0.152: v46,26.8 48.48,29.28 JP1.1
MOSI  (via drill 0.35)
  Top 0.152: v47.2,26.8 49.01,24.99 U1.15
  Bottom 0.152: v47.2,26.8 49.8,29.4 49.8,33.79 JP1.4
N$1
  Top 0.508: LTV826S-LTV816S.3 14.38,7.82 14,8.2 12.04,8.2 R16.2
N$2
  Top 0.254: X1.3 7.24,10.09 10.49,6.84 13.1,6.84 14.66,5.28 LTV826S-LTV816S.4
N$3
  Top 0.254: LTV826S-LTV816S.2 14.24,10.36 13,11.6 8.4,11.6 4.83,15.17 X1.2
N$4
  Top 0.508: LTV826S-LTV816S.1 12.24,12.9 R14.2
N$5
  Top 0.508: R22.1 29.15,49.65 29.8,49 30.8,49 31.8,48 31.8,45.6 30.98,44.77 U5.7
N$6
  Top 0.152: LED6.C 19,30 19.2,30.2 19.2,30.4 19.62,30.82 U$1.17
N$7
  Top 0.152: R2.2 14.4,34.65 LED5.A
N$8
  Top 0.152: R17.2 14.38,32.33 LED1.A
N$9
  Top 0.152: C3.1 60.65,22.55 Q1.1 56.79,19.95 U1.7
N$10
  Top 0.152: C4.1 60.67,28.65 Q1.2 57.02,25 57,25 56.8,24.8 56.8,21.6 55.93,20.73 U1.8
N$11  (via drill 0.35)
  Top 0.508: U5.6 23.45,46.05 v23.4,46 | v21.6,46 18.6,46 17.8,45.2 3,45.2 1.4,46.8 1.4,49.56 X4.2 8.86,52.34 9.71,51.49 C12.1 11.2,51.46 11.2,50.6 11.5,50.3 D2.C
  Bottom 0.508: v23.4,46 v21.6,46
N$12
  Top 0.508: R3.1 36.55,45.25 35.76,46.05 U5.3
N$13
  Top 0.508: TS2596SCS.2 30.41,57.02 32,58.6 32,59.8 32.8,60.6 34.2,60.6 35.66,59.14 D1.C 41.41,59.14 L-05HCP33.P$1
N$14
  Top 0.508: TS2596SCS.3 30.25,55.74 31,55 31,54 31.8,53.2 35.4,53.2 37.4,51.2 39,51.2 41.65,48.55 C11.2 45.15,48.55 R8.1 45.33,48.37 R4.2
N$15
  Top 0.152: R7.2 12.2,42.21
  Top 0.254: R7.2 12.16,43.24 11.8,43.6 2.8,43.6 1.8,42.6 1.8,38.1 JP3.6 | 12.2,42.21 14.39,42.21 18.2,38.4 20.84,38.4 U$1.11
  Top 0.508: JP3.6 JP3.5
N$16  (via drill 0.35)
  Top 0.508: v7.2,29.4 7.2,26.47 D6.3 8.03,26.37 9.41,24.99 D7.A
  Bottom 0.508: JP3.3 7.2,32.7 v7.2,29.4
N$17
  Top 0.508: TASTER9313-1.P$1 TASTER9313-1.P$2 41.77,43.58 41.39,43.2 38.01,43.2 R3.2 37.86,42.05 37.41,41.6 25,41.6 24.05,42.55 R5.1
N$18
  Top 1.27: X4.3 D3.A
N$19  (via drill 0.35)
  Top 0.508: v4.2,29.4 4.2,28.4 3.18,27.38 D4.3 3.21,26.4 4,26.4 5.2,25.2 5.2,23.2 5.54,22.86 D8.A
  Bottom 0.508: v4.2,29.4 4.31,29.51 4.31,33.05 JP3.4
N$20
  Top 0.508: D7.C 15.68,24.99 R11.2
N$21
  Top 0.152: 12.2,39.63 R9.2 12.2,39.67
  Top 0.254: JP3.7 6.98,41 12,41 12.2,40.8 12.2,39.63 | 12.2,39.67 15.53,39.67 18.03,37.17 U$1.12
N$22
  Top 0.508: D8.C 15.8,22.86 R6.1
N$23
  Top 0.152: U$1.16 20.78,32.11 19.49,32.11 19.2,32.4 LED1.C
N$25
  Top 0.152: R21.2 14.38,30.07 LED6.A
N$26
  Top 0.152: LED5.C 18.8,34.6 19,34.4 19,33.8 19.44,33.36 U$1.15
N$28
  Top 0.254: JP3.8 4.04,38.4 12,38.4 12.16,38.24 R10.2 16.71,37.09 18,35.8 20.78,35.8 U$1.13
NSLP  (via drill 0.35)
  Top 0.152: U5.2 34.1,44.9 35.3,44.9 35.6,44.6 v35.6,42.6 | v38.3,26.5 38.4,26.4 38.4,15.6 41.6,12.4 49,12.4 49.01,12.41 50.19,12.41 v50.2,12.4 | v38.8,30.2 38.91,30.31 38.91,31.15 35.6,34.46 v35.6,40.4 | v56,11.6 56.4,12 56.4,15.8 56.2,16 55.2,16 U1.2
  Bottom 0.152: v38.8,30.2 38.3,29.7 v38.3,26.5 | v35.6,42.6 v35.6,40.4 | v50.2,12.4 51,11.6 v56,11.6
O0
  Top 0.152: U$1.7 30.63,37.17 30.66,37.2 32.2,37.2 32.8,36.6 32.8,34.2 38,29 49,29 53.03,24.97 U1.10
O1
  Top 0.152: U$1.6 30.6,35.9 30.7,36 31.8,36 32.2,35.6 32.2,34 37.6,28.6 48.6,28.6 52.21,24.99 U1.11
P0  (via drill 0.35)
  Top 0.152: JP2.3 37.47,10.42 36.84,9.79 R19.2 | U1.23 45.73,15.93 45,15.2 43.39,15.2 v42.63,14.43
  Bottom 0.152: v42.63,14.43 38.67,10.48 JP2.3
P1  (via drill 0.35)
  Top 0.152: JP2.1 41.76,9.87 R18.2 | U1.24 47,15.05 47,14.6 46.83,14.43 v44.3,14.43
  Bottom 0.152: v44.3,14.43 44.3,13.52 JP2.1
PWM
  Top 0.152: U1.9 53.81,24.99 49.4,29.4 38.4,29.4 33.4,34.4 33.4,37.4 32.36,38.44 U$1.8
RESET  (via drill 0.35)
  Top 0.152: JP1.5 57.71,36.62 TASTER9313-2.P$1 TASTER9313-2.P$2 65.71,38.89 68,36.6 68,10 65.8,10 63,7.2 63,5.2 61.15,3.34 v57.26,3.34 | v55.2,12.39 55.2,8.4 v57.2,6.4 R1.2 | U1.29 51.43,12.43 v51.4,12.41
  Bottom 0.152: v51.4,12.41 v51.4,12.4 v55.2,12.39 | v57.26,3.34 57.2,4.8 v57.2,6.4
RX  (via drill 0.35)
  Top 0.152: U1.30 52.21,12.01 51.8,11.6 49,11.6 48.6,12 41,12 37.2,15.8 v37.2,26.6 | v37.9,31.1 34,34.8 v34,40.4 | U5.1 34,43.48 v34,42.6 | R23.1 41.25,24.15 39.6,25.8 v39.2,25.8
  Bottom 0.152: v37.9,31.1 37.9,27.3 v37.2,26.6 38,25.8 v39.2,25.8 | v34,42.6 v34,40.4
TX  (via drill 0.35)
  Top 0.152: v35.6,27.2 35.6,15.6 39.6,11.6 48.4,11.6 48.8,11.2 52.4,11.2 53.03,11.83 U1.31 | v39.6,44.2 39.6,46.2 38.48,47.31 U5.4 | v39.6,42.2 39.6,35.8 v37.6,33.8
  Bottom 0.152: v35.6,27.2 35.6,31.8 v37.6,33.8 | v39.6,42.2 v39.6,44.2